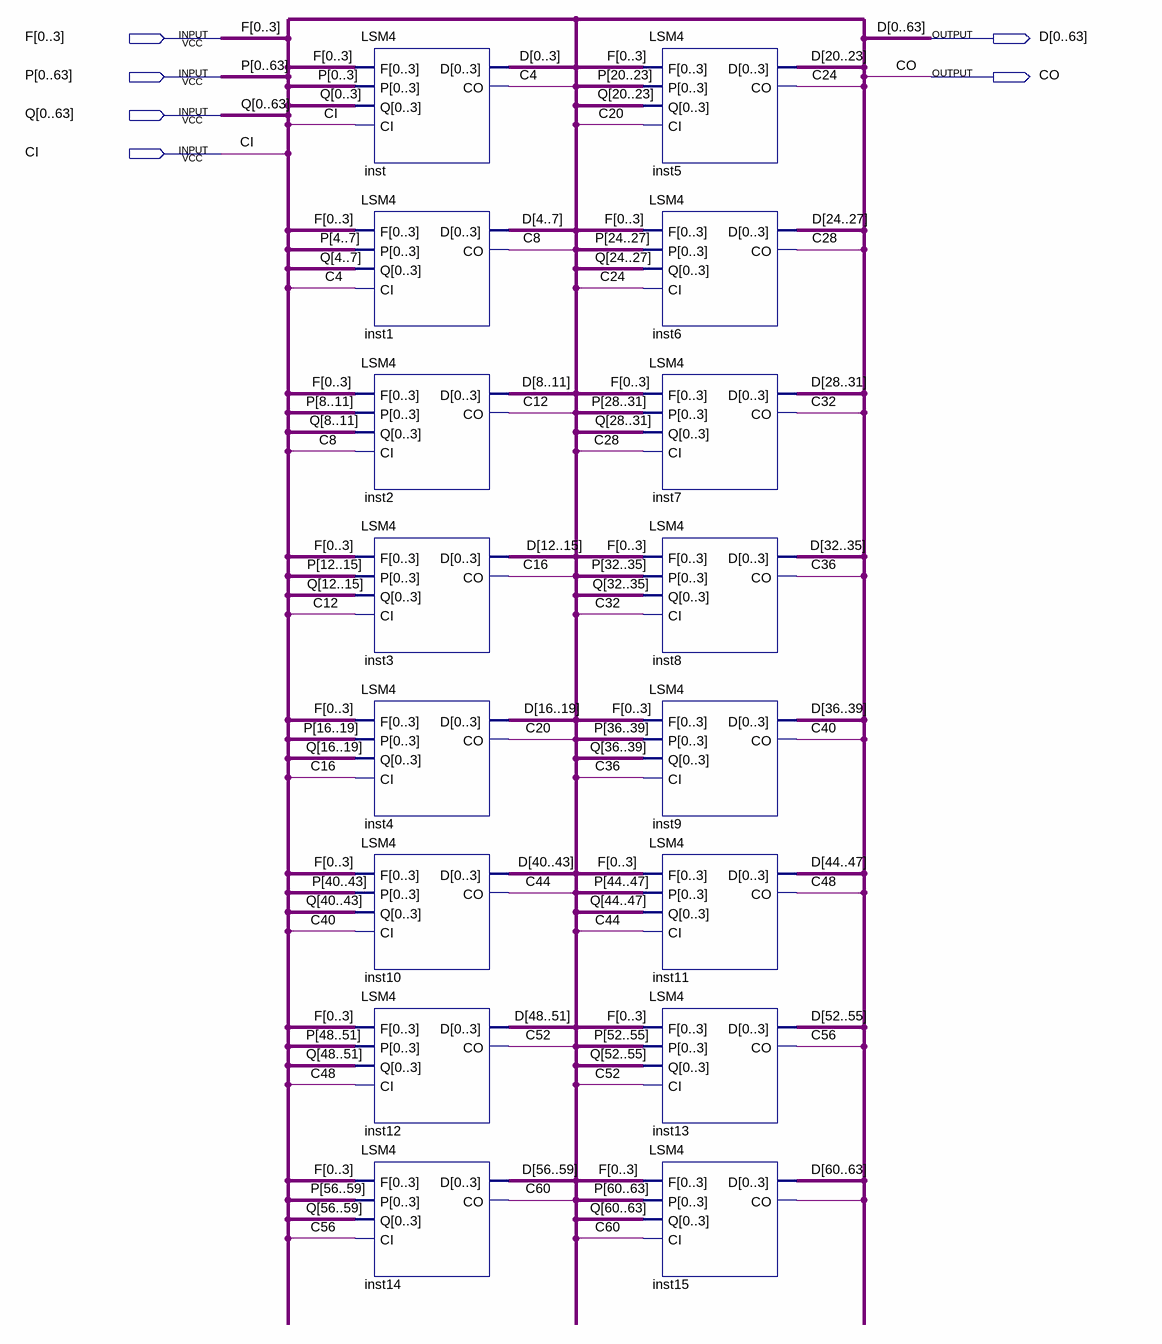
[diagram p0: schematic sheet]
// Quartus schematic LSM40.bdf as structural Verilog: 16 symbols, 6 pins
module LSM40 (
  input  [0:3] F,
  input  [0:63] P,
  input  [0:63] Q,
  input  CI,
  output [0:63] D,
  output CO
);

  wire C4, C8, C12, C16, C20, C24, C28, C32, C36, C40, C44, C48, C52, C56, C60, inst15_co;

  LSM4 inst (.F(F), .P(P[0:3]), .Q(Q[0:3]), .CI(CI), .D(D[0:3]), .CO(C4));
  LSM4 inst1 (.F(F), .P(P[4:7]), .Q(Q[4:7]), .CI(C4), .D(D[4:7]), .CO(C8));
  LSM4 inst2 (.F(F), .P(P[8:11]), .Q(Q[8:11]), .CI(C8), .D(D[8:11]), .CO(C12));
  LSM4 inst3 (.F(F), .P(P[12:15]), .Q(Q[12:15]), .CI(C12), .D(D[12:15]), .CO(C16));
  LSM4 inst4 (.F(F), .P(P[16:19]), .Q(Q[16:19]), .CI(C16), .D(D[16:19]), .CO(C20));
  LSM4 inst10 (.F(F), .P(P[40:43]), .Q(Q[40:43]), .CI(C40), .D(D[40:43]), .CO(C44));
  LSM4 inst12 (.F(F), .P(P[48:51]), .Q(Q[48:51]), .CI(C48), .D(D[48:51]), .CO(C52));
  LSM4 inst14 (.F(F), .P(P[56:59]), .Q(Q[56:59]), .CI(C56), .D(D[56:59]), .CO(C60));
  LSM4 inst5 (.F(F), .P(P[20:23]), .Q(Q[20:23]), .CI(C20), .D(D[20:23]), .CO(C24));
  LSM4 inst6 (.F(F), .P(P[24:27]), .Q(Q[24:27]), .CI(C24), .D(D[24:27]), .CO(C28));
  LSM4 inst7 (.F(F), .P(P[28:31]), .Q(Q[28:31]), .CI(C28), .D(D[28:31]), .CO(C32));
  LSM4 inst8 (.F(F), .P(P[32:35]), .Q(Q[32:35]), .CI(C32), .D(D[32:35]), .CO(C36));
  LSM4 inst9 (.F(F), .P(P[36:39]), .Q(Q[36:39]), .CI(C36), .D(D[36:39]), .CO(C40));
  LSM4 inst11 (.F(F), .P(P[44:47]), .Q(Q[44:47]), .CI(C44), .D(D[44:47]), .CO(C48));
  LSM4 inst13 (.F(F), .P(P[52:55]), .Q(Q[52:55]), .CI(C52), .D(D[52:55]), .CO(C56));
  LSM4 inst15 (.F(F), .P(P[60:63]), .Q(Q[60:63]), .CI(C60), .D(D[60:63]), .CO(inst15_co));
endmodule
